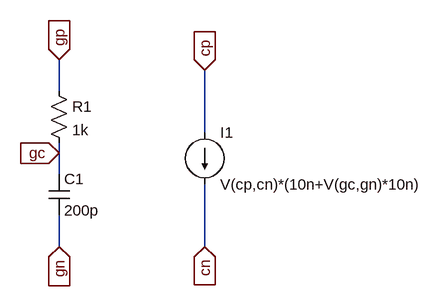
[diagram p0: schematic Draft2.asc]
Draft2.asc, the LTspice schematic file:
Version 4
SHEET 1 880 680
WIRE 160 80 160 32
WIRE 384 144 384 48
WIRE 160 176 160 160
WIRE 160 208 160 176
WIRE 160 320 160 272
WIRE 384 320 384 224
FLAG 384 48 cp
IOPIN 384 48 In
FLAG 384 320 cn
IOPIN 384 320 In
FLAG 160 32 gp
IOPIN 160 32 In
FLAG 160 176 gc
IOPIN 160 176 In
FLAG 160 320 gn
IOPIN 160 320 In
SYMBOL res 144 64 R0
SYMATTR InstName R1
SYMATTR Value 1k
SYMBOL cap 144 208 R0
SYMATTR InstName C1
SYMATTR Value 200p
SYMBOL current 384 144 R0
SYMATTR InstName I1
SYMATTR Value V(cp,cn)*(10n+V(gc,gn)*10n)

The netlist it stands for:
* Draft2.asc
R1 gp gc 1k
C1 gc gn 200p
I1 cp cn V(cp,cn)*(10n+V(gc,gn)*10n)
.backanno
.end